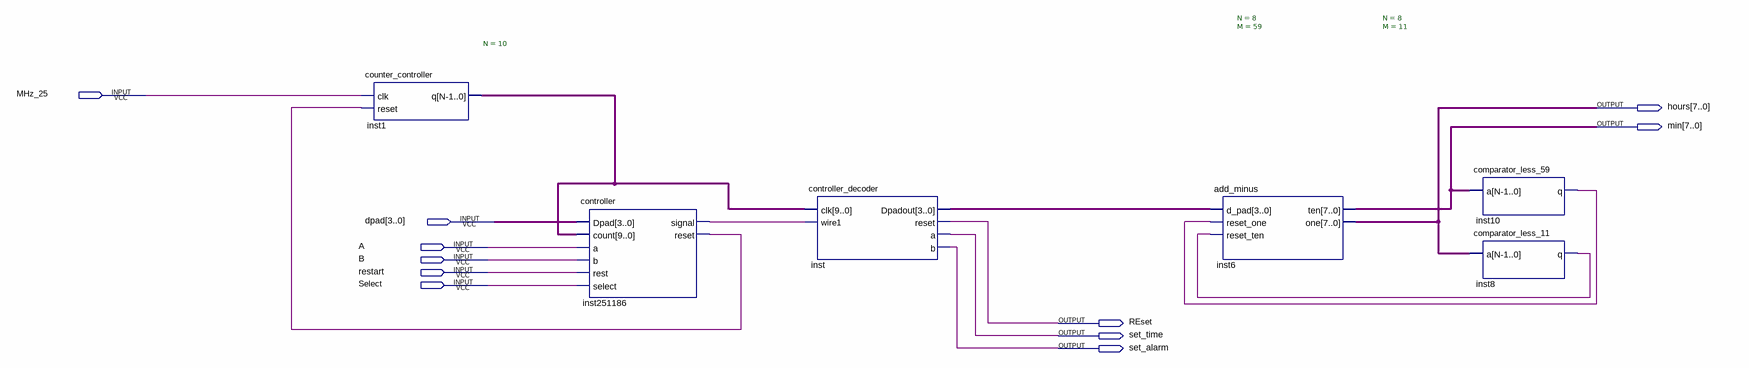
[diagram p0: schematic sheet]
// Quartus schematic top_controller.bdf as structural Verilog: 6 symbols, 11 pins
module top_controller (
  input  MHz_25,
  input  [3:0] dpad,
  input  A,
  input  B,
  input  restart,
  input  Select,
  output [7:0] hours,
  output [7:0] min,
  output REset,
  output set_time,
  output set_alarm
);

  wire inst8_q, inst10_q, inst251186_reset, inst251186_signal;
  wire [3:0] inst_dpadout;
  wire [9:0] inst1_q;

  counter_controller #(.N(10)) inst1 (.clk(MHz_25), .reset(inst251186_reset), .q(inst1_q));
  controller inst251186 (
    .Dpad(dpad), .count(inst1_q), .a(A), .b(B), .rest(restart), .select(Select), .signal(inst251186_signal),
    .reset(inst251186_reset));
  controller_decoder inst (
    .clk(inst1_q), .wire1(inst251186_signal), .Dpadout(inst_dpadout), .reset(REset), .a(set_time),
    .b(set_alarm));
  add_minus inst6 (.d_pad(inst_dpadout), .reset_one(inst10_q), .reset_ten(inst8_q), .ten(min), .one(hours));
  comparator_less_59 #(.N(8), .M(59)) inst10 (.a(min), .q(inst10_q));
  comparator_less_11 #(.N(8), .M(11)) inst8 (.a(hours), .q(inst8_q));
endmodule
